# EAGLE schematic ParaPower Basic (EAGLE 9.3.0)
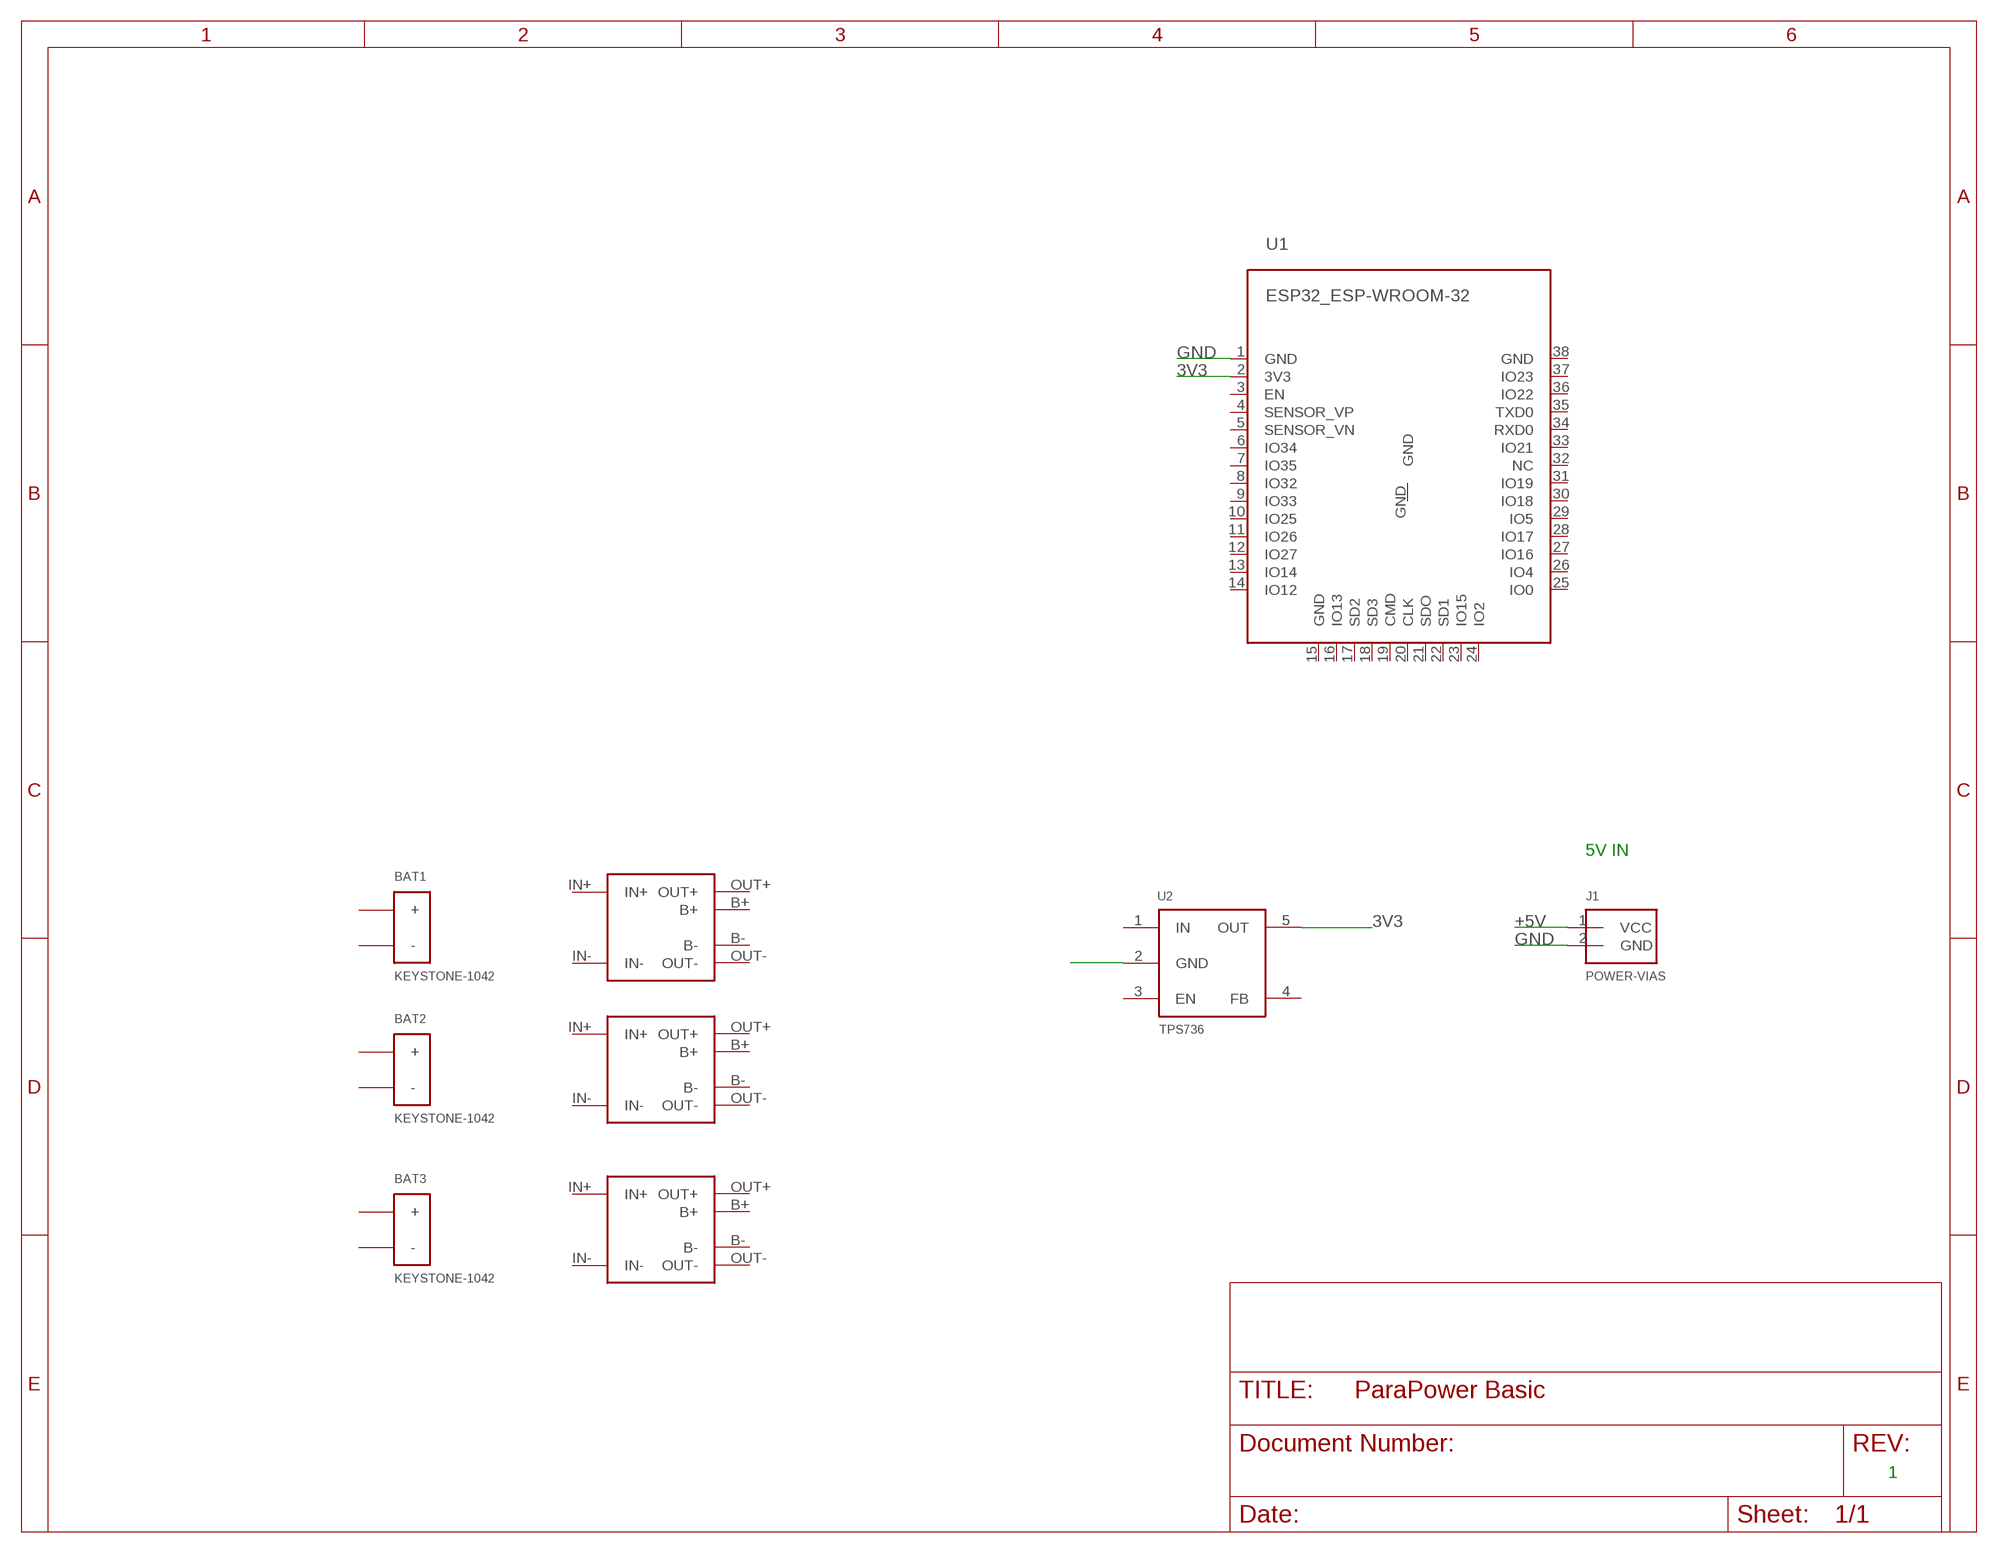
[diagram p0: schematic, sheet 1]

## Parts
BAT1  KEYSTONE-1042  [KEYSTONE_1042]
BAT2  KEYSTONE-1042  [KEYSTONE_1042]
BAT3  KEYSTONE-1042  [KEYSTONE_1042]
J1  POWER-VIAS  [2CT-VIAS]
U1  ESP32_ESP-WROOM-32  [ESP32_ESP-WROOM-32]
U2  TPS736  [SOT23-5L]
U$1  TP4056-MODULE  [TP4056-LITHIUM-PROTECTED-MODULE]
U$2  TP4056-MODULE  [TP4056-LITHIUM-PROTECTED-MODULE]
U$3  TP4056-MODULE  [TP4056-LITHIUM-PROTECTED-MODULE]

## Nets
3V3: U1.2(3V3) U2.5(OUT)
+5V: J1.1(VCC)
GND: J1.2(GND) U1.1(GND) U2.2(GND)
Unconnected: U1.3(EN) U1.4(SENSOR_VP) U1.5(SENSOR_VN) U1.6(IO34) U1.7(IO35) U1.8(IO32) U1.9(IO33) U1.10(IO25) U1.11(IO26) U1.12(IO27) U1.13(IO14) U1.14(IO12) U1.15(GND) U1.16(IO13) U1.17(SD2) U1.18(SD3) U1.19(CMD) U1.20(CLK) U1.21(SDO) U1.22(SD1) U1.23(IO15) U1.24(IO2) U1.25(IO0) U1.26(IO4) U1.27(IO16) U1.28(IO17) U1.29(IO5) U1.30(IO18) U1.31(IO19) U1.32(NC) U1.33(IO21) U1.34(RXD0) U1.35(TXD0) U1.36(IO22) U1.37(IO23) U1.38(GND) U1.GND U2.3(EN) U2.4(FB)

## Notes on the sheet
- 5V IN
- 1

## Power pins joined to a net without a drawn wire
+: BAT1.1(+) BAT2.1(+) BAT3.1(+)
-: BAT1.2(-) BAT2.2(-) BAT3.2(-)
B+: U$1.B+ U$2.B+ U$3.B+
B-: U$1.B- U$2.B- U$3.B-
IN: U2.1(IN)
IN+: U$1.IN+ U$2.IN+ U$3.IN+
IN-: U$1.IN- U$2.IN- U$3.IN-
OUT+: U$1.OUT+ U$2.OUT+ U$3.OUT+
OUT-: U$1.OUT- U$2.OUT- U$3.OUT-

## Library data of the parts
BAT1-BAT3 = VanEagleLib:KEYSTONE-1042
J1 = VanEagleLib:POWER-VIAS: Generic through-hole vias, meant for connection to external power jack or high-current device.
U1 = VCO - Pod Daughterboard v2.0:ESP32_ESP-WROOM-32
U2 = VanEagleLib:TPS736: TI TPS73601DBVR - LDO Adjustable Regulator in SOT-23-5 package
U$1-U$3 = userlib:TP4056-MODULE